# Altium schematic sheet TRIG_DIST.SchDoc
size A3; DocumentNumber: 35; SheetNumber: 35; SheetTotal: 35
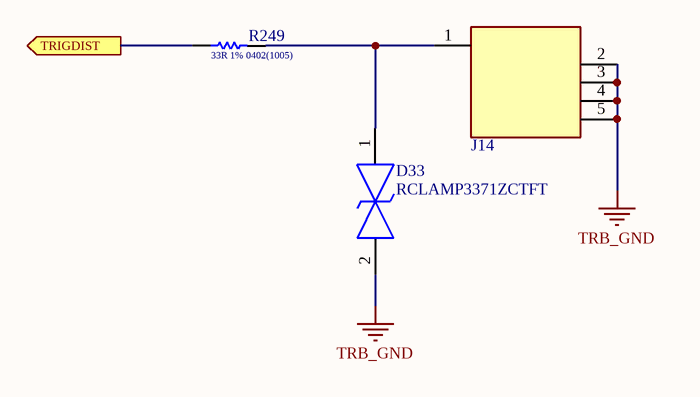
[diagram p0: TRIG_DIST.SchDoc]

## Parts
D33  RCLAMP3371ZCTFT  [RCLAMP3371ZCTFT]
J14  SMA JACK 50 OHM  [Amphenol_132289_0]  (value not drawn)
R249  33R 1% 0402(1005)  [RESC0402(1005)_L]

## Ports
TRIGDIST (out)

## Nets
TRB_GND: D33.2 J14.2(MNT_1) J14.3(MNT_2) J14.4(MNT_3) J14.5(MNT_4)
TRIGDIST: R249.1 ; port TRIGDIST
NetD33_1: D33.1 J14.1 R249.2

## Notes on the sheet
- 475 Portola Plaza
- GAPS TOF
- Los Angeles, CA
- Takeru Hayashi
- 310-825-0344
- Size:
- Date:
- Letter
- Revision:
- Time:
- Sheet
- of
- takeruhayashi@g.ucla.edu
- andrew.peck@cern.ch
- Andrew Peck
- File:

## Library data of the parts
D33 = RCLAMP3371ZCTFT: TVS Diode (Bi-directional); Manufacturer_Name: SEMTECH; Datasheet Link: https://www.mouser.com/datasheet/2/761/RClamp3371ZC-1626951.pdf; Height: 0.265mm; Manufacturer_Part_Number: RCLAMP3371ZCTFT; Mouser Part Number: 947-RCLAMP3371ZCTFT; Mouser Price/Stock: https://www.mouser.co.uk/ProductDetail/Semtech/RCLAMP3371ZCTFT?qs=55YtniHzbhAJYX2KWxFhdA%3D%3D; Arrow Part Number: RCLAMP3371ZCTFT; Arrow Price/Stock: https://www.arrow.com/en/products/rclamp3371zctft/semtech?region=nac
J14 = Conn_Amphenol_132289_eec: CONN SMA JACK 50 OHM EDGE MNT; Part Number: 132289; helpURL: https://upverter.com/upn/revision/b04227f5d74ab481/; ComponentLink2Description: Datasheet; Temperature: -65°C to +165°C; Package: CONN_SMA_9MM52_7M92; Supplier 2: Mouser; Price: 4.87219999201; Supplier 1: Digi-Key; ComponentLink1URL: https://upverter.com/upn/revision/b04227f5d74ab481/; Supplier Part Number 2: 523-132289; Supplier Part Number 1: ACX1426-ND; Manufacturer: Amphenol; ComponentLink1Description: Upverter; ComponentLink2URL: http://www.amphenolrf.com/downloads/dl/file/id/2775/product/2917/132289_customer_drawing.pdf; RoHS: TRUE; Mouser Part Number: 523-132289; Digikey Description: CONN SMA JACK 50 OHM EDGE MNT; Digikey Part Number: ACX1426-ND; Lead Free: yes; Temperature Range Low: -65°C; Temperature Range High: +165°C
R249 = CMP-1011-00341-1: 33R 0.063W 1% 0402 (1005 Metric)  SMD; Case-Metric: 1005; Value: 33.00 Ohm; Case-EIA: 0402; Tolerance: 1 %; Power: 0.063 W; Technology: SMT